# EAGLE design franzboard_V01_EAGLE61 (EAGLE 6.1)
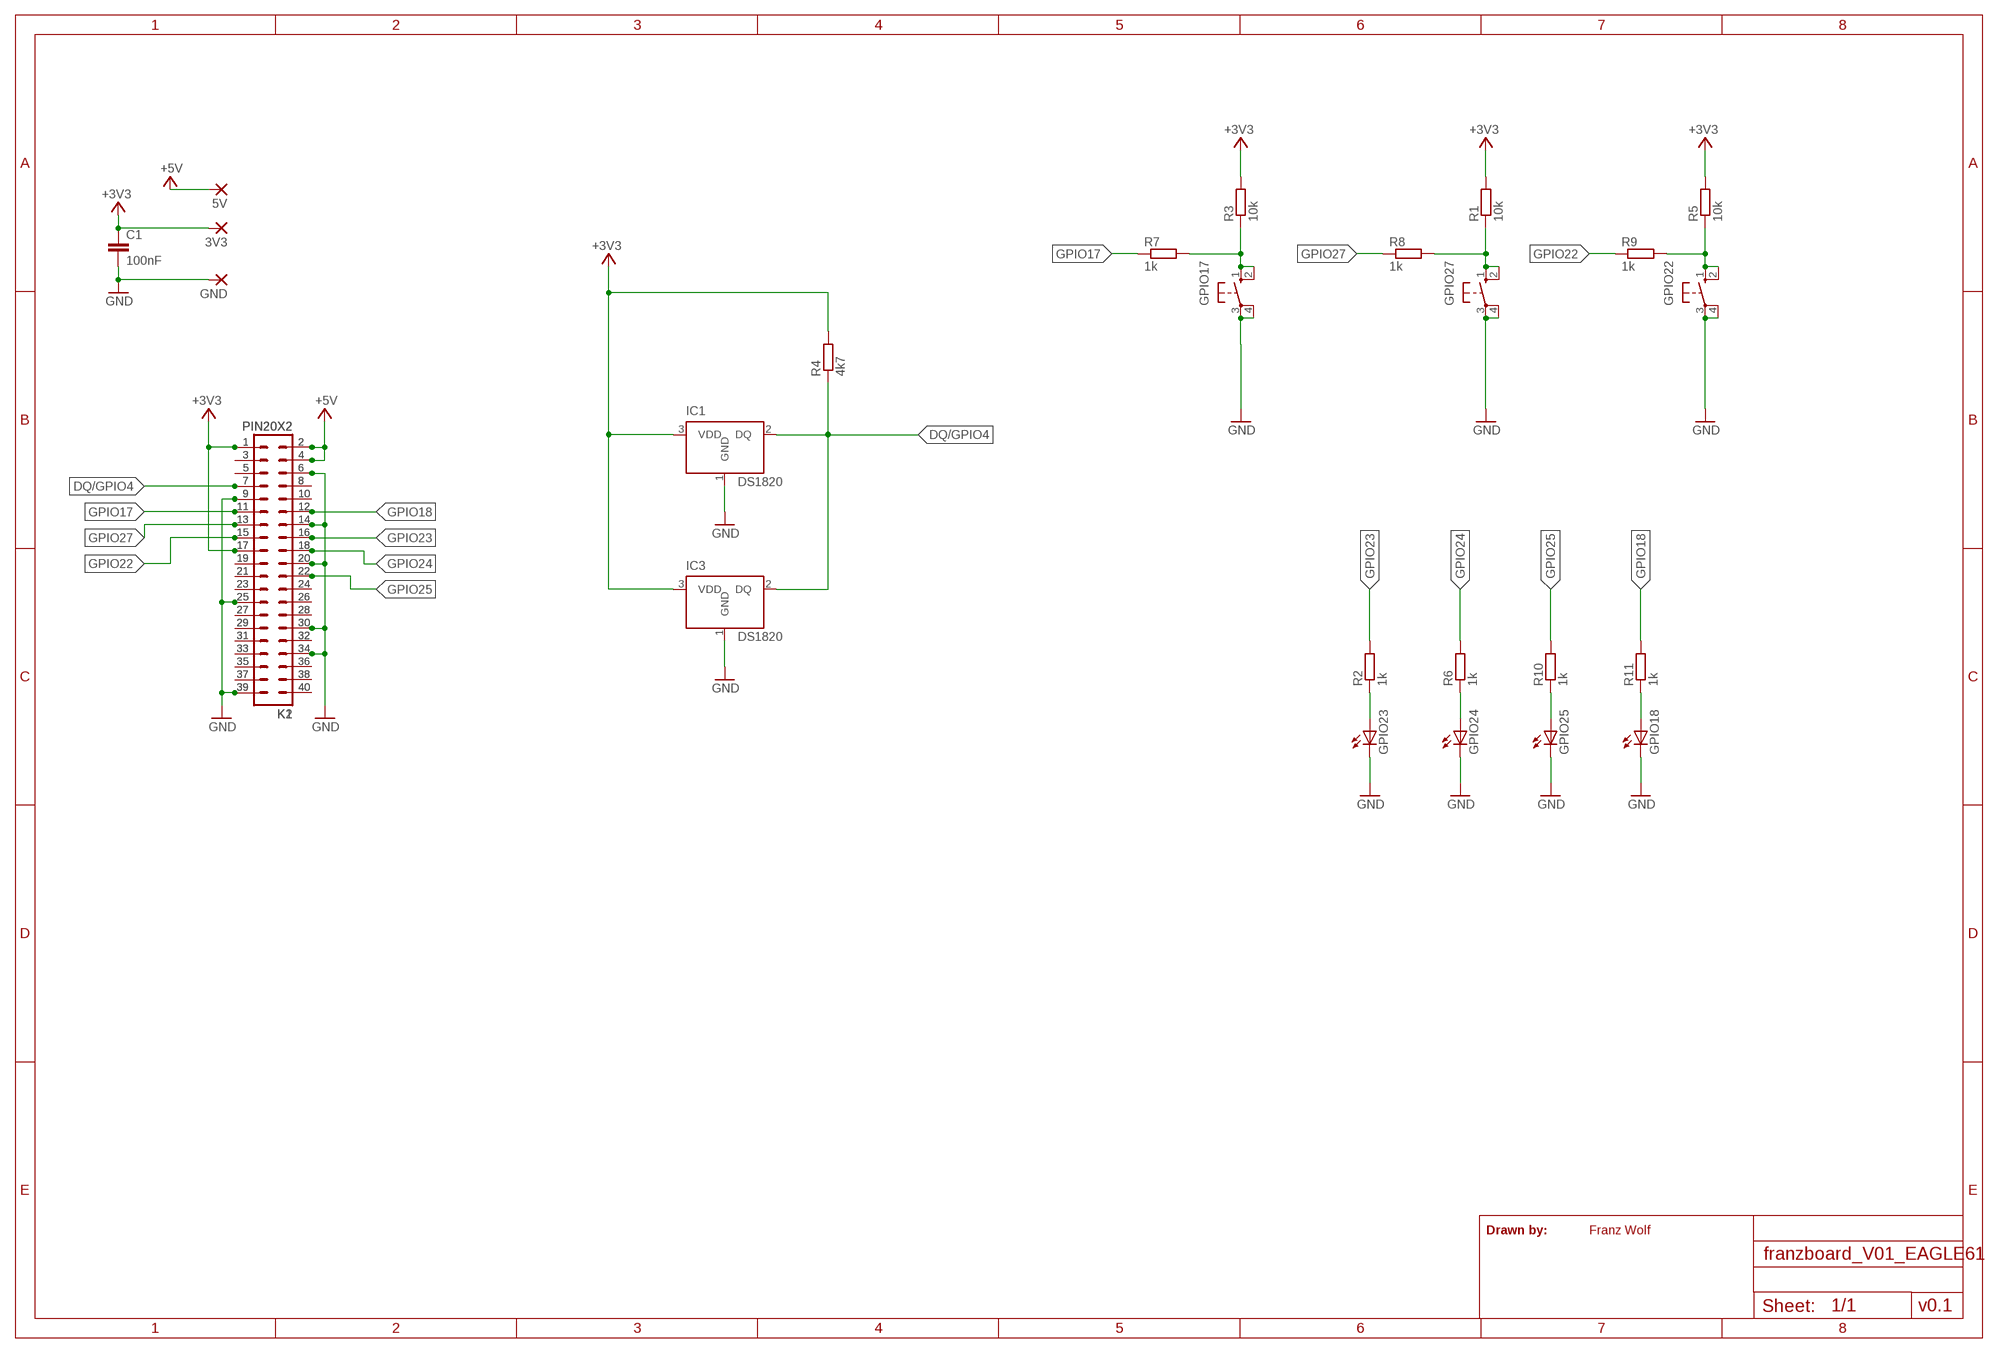
[diagram p0: schematic, sheet 1]

## Parts
3V3  1,6/0,8  [1,6/0,8]
5V  1,6/0,8  [1,6/0,8]
C1  100nF  C-EUC1206  [C1206]
GND  1,6/0,8  [1,6/0,8]
GPIO17  10-XX  [B3F-10XX]
GPIO18  LEDSMT1206  [1206]
GPIO22  10-XX  [B3F-10XX]
GPIO23  LEDSMT1206  [1206]
GPIO24  LEDSMT1206  [1206]
GPIO25  LEDSMT1206  [1206]
GPIO27  10-XX  [B3F-10XX]
IC1  DS1820  [TO-92]
IC3  DS1820  [TO-92]
K1  PIN20X2  [PIN_20X2]
K2  PIN20X2  [PIN_20X2]
R1  10k  R-EU_R1206  [R1206]
R2  1k  R-EU_R1206  [R1206]
R3  10k  R-EU_R1206  [R1206]
R4  4k7  R-EU_R1206  [R1206]
R5  10k  R-EU_R1206  [R1206]
R6  1k  R-EU_R1206  [R1206]
R7  1k  R-EU_R1206  [R1206]
R8  1k  R-EU_R1206  [R1206]
R9  1k  R-EU_R1206  [R1206]
R10  1k  R-EU_R1206  [R1206]
R11  1k  R-EU_R1206  [R1206]

## Nets
+3V3: 3V3.1(P) C1.1 IC1.3(VDD) IC3.3(VDD) K1.1 K1.17 K2.1 K2.17 R1.2 R3.2 R4.2 R5.2
+5V: 5V.1(P) K1.2 K1.4 K2.2 K2.4
DQ/GPIO4: IC1.2(DQ) IC3.2(DQ) K1.7 K2.7 R4.1
GND: C1.2 GND.1(P) GPIO17.3(P) GPIO17.4(P1) GPIO18.C GPIO22.3(P) GPIO22.4(P1) GPIO23.C GPIO24.C GPIO25.C GPIO27.3(P) GPIO27.4(P1) IC1.1(GND) IC3.1(GND) K1.6 K1.9 K1.14 K1.20 K1.25 K1.30 K1.34 K1.39 K2.6 K2.9 K2.14 K2.20 K2.25 K2.30 K2.34 K2.39
GPIO17: K1.11 K2.11 R7.1
GPIO18: K1.12 K2.12 R11.2
GPIO22: K1.15 K2.15 R9.1
GPIO23: K1.16 K2.16 R2.2
GPIO24: K1.18 K2.18 R6.2
GPIO25: K1.22 K2.22 R10.2
GPIO27: K1.13 K2.13 R8.1
N$1: K1.3 K2.3
N$2: K1.5 K2.5
N$3: GPIO23.A R2.1
N$4: GPIO17.1(S) GPIO17.2(S1) R3.1 R7.2
N$5: GPIO27.1(S) GPIO27.2(S1) R1.1 R8.2
N$6: GPIO22.1(S) GPIO22.2(S1) R5.1 R9.2
N$7: GPIO24.A R6.1
N$8: GPIO25.A R10.1
N$9: GPIO18.A R11.1
N$10: K1.19 K2.19
N$11: K1.21 K2.21
N$12: K1.23 K2.23
N$13: K1.24 K2.24
N$14: K1.26 K2.26
N$15: K1.27 K2.27
N$16: K1.29 K2.29
N$17: K1.28 K2.28
N$18: K1.31 K2.31
N$19: K1.33 K2.33
N$20: K1.32 K2.32
N$21: K1.36 K2.36
N$22: K1.38 K2.38
N$23: K1.40 K2.40
N$24: K1.35 K2.35
N$25: K1.37 K2.37
RXD: K1.10 K2.10
TXD: K1.8 K2.8

## Notes on the sheet
- Drawn by: | Franz Wolf
- v0.1

## Library data of the parts
3V3 5V GND = wirepad:1,6/0,8: THROUGH-HOLE PAD
C1 = resistor:C-EU: CAPACITOR, European symbol; DIELECTRIC: X7R
GPIO17 GPIO22 GPIO27 = switch-omron:10-XX: OMRON SWITCH; MPN: B3F-1000; OC_FARNELL: 176432; OC_NEWARK: 36M3542
GPIO18 GPIO23-GPIO25 = led:LED: LED OSRAM: - CHIPLED LG R971, LG N971, LY N971, LG Q971, LY Q971, LO R971, LY R971 LH N974, LH R974 LS Q976, LO Q976, LY Q976 LO Q996 - Hyper CHIPLED LW Q18S LB Q993, LB Q99A, LB R99A - SideLED LS A670, LO A670, LY A670, LG A670, LP A670 LB A673, LV A673, LT A673, LW A673 LH A674 LY A675 LS A676, LA A676, LO A676, LY A676, LW A676 LS A679, LY A679, LG A679 - Hyper Micro SIDELED® LS Y876, LA Y876, LO Y876, LY Y876 LT Y87S - SmartLED LW L88C, LW L88S LB L89C, LB L89S, LG L890 LS L89K, LO L89K, LY L89K LS L896, LA L896, LO L896, LY L896 - TOPLED LS T670, LO T670, LY T670, LG T670, LP T670 LSG T670, LSP T670, LSY T670, LOP T670, LYG T670 LG T671, LOG T671, LSG T671 LB T673, LV T673, LT T673, LW T673 LH T674 LS T676, LA T676, LO T676, LY T676, LB T676, LH T676, LSB T676, LW T676 LB T67C, LV T67C, LT T67C, LS T67K, LO T67K, LY T67K, LW E67C LS E67B, LA E67B, LO E67B, LY E67B, LB E67C, LV E67C, LT E67C LW T67C LS T679, LY T679, LG T679 LS T770, LO T770, LY T770, LG T770, LP T770 LB T773, LV T773, LT T773, LW T773 LH T774 LS E675, LA E675, LY E675, LS T675 LS T776, LA T776, LO T776, LY T776, LB T776 LHGB T686 LT T68C, LB T68C - Hyper Mini TOPLED® LB M676 - Mini TOPLED Santana® LG M470 LS M47K, LO M47K, LY M47K Source: http://www.osram.convergy.de LUXEON: - LUMILED® LXK2-PW12-R00, LXK2-PW12-S00, LXK2-PW14-U00, LXK2-PW14-V00 LXK2-PM12-R00, LXK2-PM12-S00, LXK2-PM14-U00 LXK2-PE12-Q00, LXK2-PE12-R00, LXK2-PE12-S00, LXK2-PE14-T00, LXK2-PE14-U00 LXK2-PB12-K00, LXK2-PB12-L00, LXK2-PB12-M00, LXK2-PB14-N00, LXK2-PB14-P00, LXK2-PB14-Q00 LXK2-PR12-L00, LXK2-PR12-M00, LXK2-PR14-Q00, LXK2-PR14-R00 LXK2-PD12-Q00, LXK2-PD12-R00, LXK2-PD12-S00 LXK2-PH12-R00, LXK2-PH12-S00 LXK2-PL12-P00, LXK2-PL12-Q00, LXK2-PL12-R00 Source: www.luxeon.com KINGBRIGHT: KA-3528ASYC Source: www.kingbright.com
IC1 IC3 = DS1820:DS1820: DS1820 - 1-Wire Digital Thermometer
K1 K2 = FLYFISH:PIN20X2
R1-R11 = rcl:R-EU_: RESISTOR, European symbol

## Board
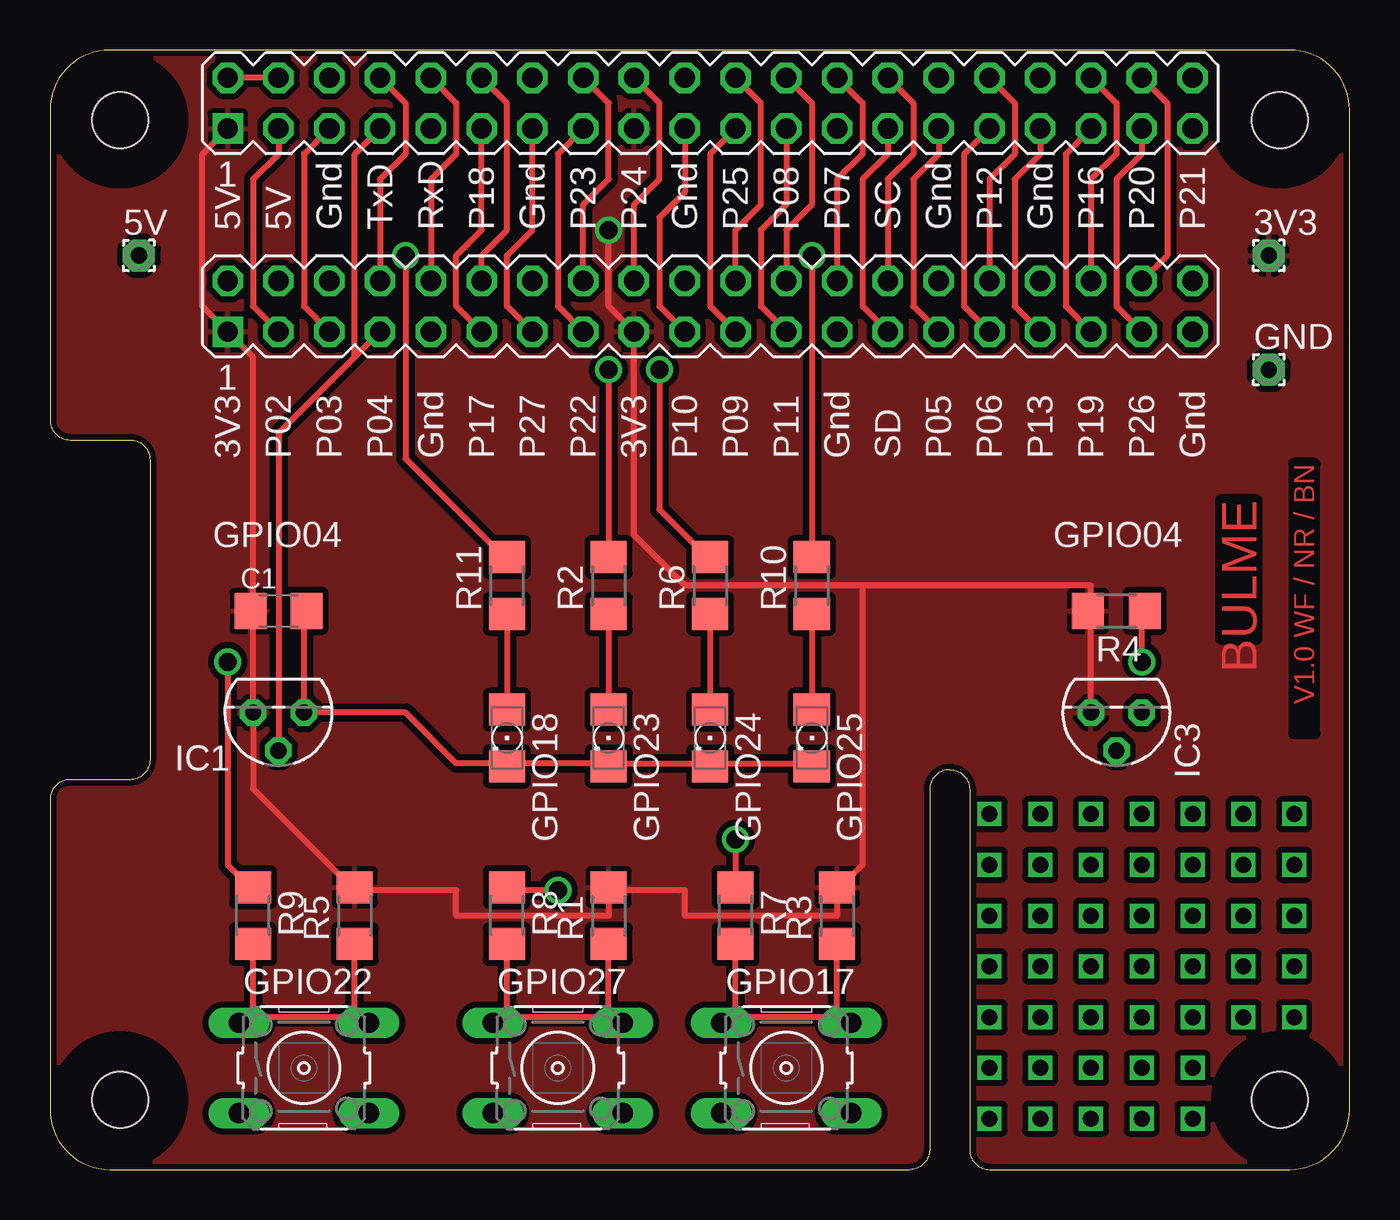
[diagram p1: board, top side]
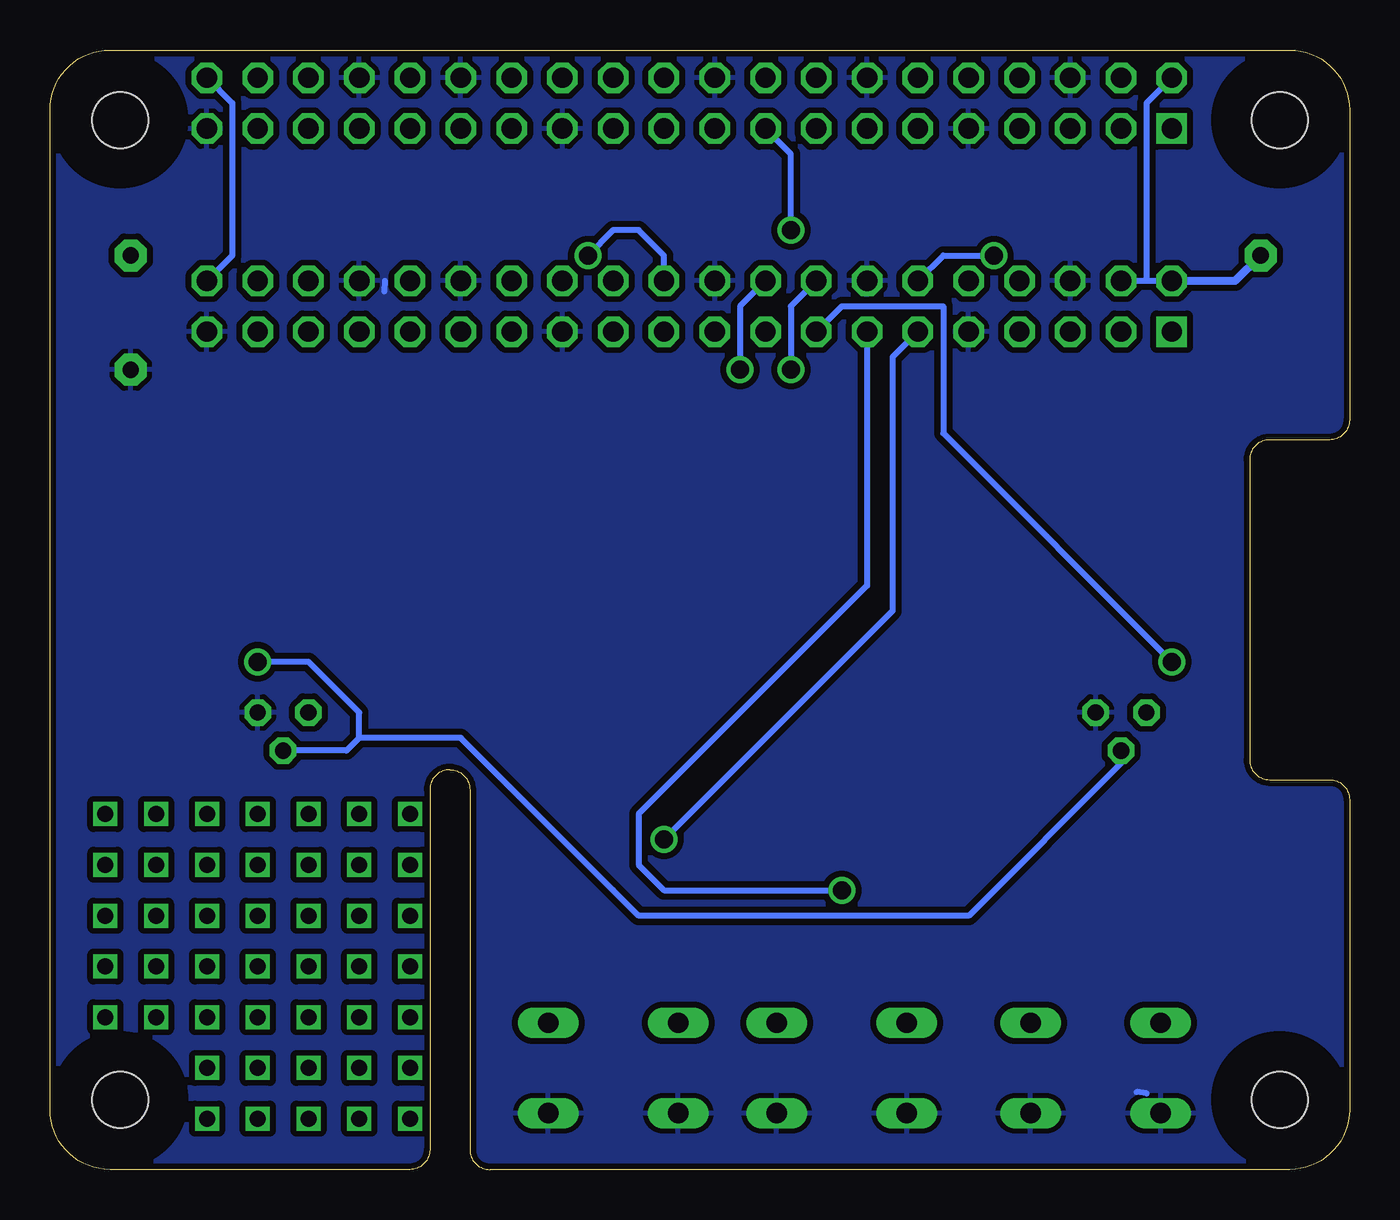
[diagram p2: board, bottom side, seen from below]

Size 65 x 56 mm. Coordinates in mm from the lower left corner, seen from the top.
Outline: 0,3 arc90 3,0 43,0 arc90 44,1 44,19 arc-90 45,20 arc-90 46,19 46,1 arc90 47,0 62,0 arc90 65,3 65,53 arc90 62,56 3,56 arc90 0,53 0,37.5 arc90 1,36.5 4,36.5 arc-90 5,35.5 5,20.5 arc-90 4,19.5 1,19.5 arc90 0,18.5 0,3
Copper layers (1*16): Top 0.035mm / dielectric 1.5mm / Bottom 0.035mm
Design rules: minimum track width 12mil, minimum drill 16mil, track to track 6mil, track to pad 8mil, pad to pad 8mil, via to via 8mil, smd to smd 0mil, copper to edge 10mil, drill to drill 12mil, minimum pad ring 10mil, minimum via ring 6mil, stop-mask expansion 2mil, vias tented up to drill 100mil, thermal gap 10mil
Holes 2.8 mm at 3.5,3.5 3.5,52.5 61.5,52.5 61.5,3.5
tRestrict: area 1.9,51 to 5,54; area 60,51 to 63,54; area 60,1.9 to 63,5; area 1.9,1.9 to 5,5
bRestrict: area 1.9,1.9 to 5,5; area 1.9,51 to 5,54; area 60,1.9 to 63,5; area 60,51 to 63,54

### Footprints (pad centres in the part's own frame; a part is rotated, then mirrored left to right if it is on the bottom)
1,6/0,8 = drill 0.813 pad 1.6 octagon: 1 0,0
C1206 = smd 1.6 x 1.8: 1 -1.4,0; 2 1.4,0
B3F-10XX = drill 1.016 long: 1 -3.251,2.261; 2 3.251,2.261; 3 -3.251,-2.261; 4 3.251,-2.261
1206 = smd 1.6 x 1.803: A -1.422,0; C 1.422,0
TO-92 = drill 0.813 pad 1.27 octagon: 1 -1.27,0; 2 0,1.905; 3 1.27,0
PIN_20X2 = drill 1.016 square: 1 -24.13,-1.27 | drill 1.016 octagon: 2 -24.13,1.27; 3 -21.59,-1.27; 4 -21.59,1.27; 5 -19.05,-1.27; 6 -19.05,1.27; 7 -16.51,-1.27; 8 -16.51,1.27; 9 -13.97,-1.27; 10 -13.97,1.27; 11 -11.43,-1.27; 12 -11.43,1.27; 13 -8.89,-1.27; 14 -8.89,1.27; 15 -6.35,-1.27; 16 -6.35,1.27; 17 -3.81,-1.27; 18 -3.81,1.27; 19 -1.27,-1.27; 20 -1.27,1.27; 21 1.27,-1.27; 22 1.27,1.27; 23 3.81,-1.27; 24 3.81,1.27; 25 6.35,-1.27; 26 6.35,1.27; 27 8.89,-1.27; 28 8.89,1.27; 29 11.43,-1.27; 30 11.43,1.27; 31 13.97,-1.27; 32 13.97,1.27; 33 16.51,-1.27; 34 16.51,1.27; 35 19.05,-1.27; 36 19.05,1.27; 37 21.59,-1.27; 38 21.59,1.27; 39 24.13,-1.27; 40 24.13,1.27
R1206 = smd 1.6 x 1.803: 1 -1.422,0; 2 1.422,0

### Placement (x,y rotation side)
3V3  60.96,45.72 0 top
5V  4.45,45.72 0 top
C1  11.43,27.94 0 top
GND  60.96,40.01 0 top
GPIO17  36.83,5.08 0 top
GPIO18  22.86,21.59 270 top
GPIO22  12.7,5.08 0 top
GPIO23  27.94,21.59 270 top
GPIO24  33.02,21.59 270 top
GPIO25  38.1,21.59 270 top
GPIO27  25.4,5.08 0 top
IC1  11.43,22.86 180 top
IC3  53.34,22.86 180 top
K1  33.02,53.34 0 top
K2  33.02,43.18 0 top
R1  27.94,12.7 90 top
R2  27.94,29.21 90 top
R3  39.37,12.7 90 top
R4  53.34,27.94 180 top
R5  15.24,12.7 90 top
R6  33.02,29.21 90 top
R7  34.29,12.7 270 top
R8  22.86,12.7 270 top
R9  10.16,12.7 270 top
R10  38.1,29.21 90 top
R11  22.86,29.21 90 top

### Tracks (layer width: path | path; a pad name or v marks a point on that pad's centre or on a via)
+3V3  (via drill 0.9)
  Top 0.305: 10.16,27.94 IC1.3 10.16,19.05 15.24,13.97 | 10.16,27.94 C1.1 10.16,27.94 | 15.24,13.97 R5.2 15.24,13.97 | 10.16,27.94 10.16,40.64 K2.1 7.62,43.18 7.62,50.8 K1.1 | 27.94,13.97 31.75,13.97 31.75,12.7 39.37,12.7 39.37,13.97 | 27.94,13.97 R1.2 27.94,13.97 | 39.37,13.97 R3.2 39.37,13.97 | IC3.3 52.07,27.94 | 52.07,27.94 R4.2 52.07,27.94 | 40.64,29.21 52.07,29.21 52.07,27.94 | 40.64,29.21 31.75,29.21 29.21,31.75 K2.17 27.94,43.18 v27.94,46.99 | 39.37,13.97 40.64,15.24 40.64,29.21 | 15.24,13.97 20.32,13.97 20.32,12.7 27.94,12.7 27.94,13.97
  Bottom 0.305: K1.17 27.94,50.8 v27.94,46.99
  pour Top (isolate 0.305): 0,3 arc90 3,0 43,0 arc90 44,1 44,19 arc-90 45,20 arc-90 46,19 46,1 arc90 47,0 62,0 arc90 65,3 65,53 arc90 62,56 3,56 arc90 0,53 0,37.5 arc90 1,36.5 4,36.5 arc-90 5,35.5 5,20.5 arc-90 4,19.5 1,19.5 arc90 0,18.5
+5V
  Top 0.305: K1.4 K1.2
  Bottom 0.305: K2.4 10.16,44.45 | 10.16,44.45 K2.2 | 10.16,44.45 10.16,53.34 K1.2
  Bottom 0.406: K2.2 5.71,44.45 5V.1
DQ/GPIO4  (via drill 0.9)
  Top 0.305: K2.7 15.24,40.64 | 15.24,40.64 11.43,36.83 11.43,21.59 IC1.2 | K1.7 15.24,50.8 15.24,40.64 | v54.61,25.4 54.61,27.94 R4.1
  Bottom 0.305: v54.61,25.4 52.07,25.4 49.53,22.86 49.53,21.59 | 49.53,21.59 44.45,21.59 36.83,13.97 35.56,12.7 19.05,12.7 11.43,20.32 IC1.2 | 49.53,21.59 50.16,20.95 IC3.2
GND
  Top 0.305: C1.2 12.7,27.94 IC1.1 17.78,22.86 20.32,20.32 22.86,20.32 | 27.94,20.32 22.86,20.32 | 22.86,20.32 GPIO18.C 22.86,20.32 | 27.94,20.32 GPIO23.C 27.94,20.32 | 27.94,20.32 33.02,20.32 | 33.02,20.32 GPIO24.C 33.02,20.32 | 33.02,20.32 38.1,20.32 GPIO25.C
  Bottom 0.305: K2.6 14.1,44.58 | K2.30 44.58,44.58 | 10.16,3.81 10.65,3.88 10.16,3.81 | 48.26,44.45 48.28,43.91 48.26,44.45
  pour Bottom (isolate 0.305): 0,3 arc90 3,0 43,0 arc90 44,1 44,19 arc-90 45,20 arc-90 46,19 46,1 arc90 47.63,0 62,0 arc90 65,3 65,53 arc90 62,56 3,56 arc90 0,53 0,37.5 arc90 1,36.5 4,36.5 arc-90 5,35.5 5,20.5 arc-90 4,19.5 1,19.5 arc90 0,18.5
GPIO17  (via drill 0.9)
  Top 0.305: v34.29,16.51 R7.1 | R7.1 34.29,13.97 R7.1 | K1.11 21.59,46.99 20.32,45.72 20.32,43.18 K2.11
  Bottom 0.305: v34.29,16.51 22.86,27.94 22.86,40.64 K2.11
GPIO18  (via drill 0.9)
  Top 0.305: v17.78,45.72 17.78,35.56 22.86,30.48 R11.2 | K1.12 22.86,53.34 22.86,46.99 21.59,45.72 K2.12
  Bottom 0.305: v17.78,45.72 20.32,45.72 K2.12
GPIO22  (via drill 0.9)
  Top 0.305: K2.15 25.4,43.18 25.4,50.8 K1.15 | v8.89,25.4 8.89,15.24 10.16,13.97 R9.1
  Bottom 0.305: v8.89,25.4 20.32,36.83 20.32,43.18 25.4,43.18 K2.15
GPIO23  (via drill 0.9)
  Top 0.305: v27.94,40.01 R2.2 | R2.2 27.94,30.48 R2.2 | K1.16 27.94,53.34 27.94,49.53 26.67,48.26 K2.16
  Bottom 0.305: v27.94,40.01 27.94,43.18 K2.16
GPIO24  (via drill 0.9)
  Top 0.305: v30.48,40.01 30.48,33.02 33.02,30.48 R6.2 | K1.18 30.48,53.34 30.48,49.53 29.21,48.26 K2.18
  Bottom 0.305: v30.48,40.01 30.48,43.18 K2.18
GPIO25  (via drill 0.9)
  Top 0.305: v38.1,45.72 R10.2 | R10.2 38.1,30.48 R10.2 | K1.22 35.56,53.34 35.56,48.26 34.29,46.99 K2.22
  Bottom 0.305: v38.1,45.72 36.83,46.99 35.56,46.99 34.29,45.72 K2.22
GPIO27  (via drill 0.9)
  Top 0.305: K1.13 24.13,46.99 22.86,45.72 22.86,43.18 K2.13 | v25.4,13.97 22.86,13.97 R8.1
  Bottom 0.305: v25.4,13.97 34.29,13.97 35.56,15.24 35.56,17.78 24.13,29.21 K2.13
N$1
  Top 0.305: K2.3 10.16,43.18 10.16,49.53 11.43,50.8 K1.3
N$2
  Top 0.305: K2.5 12.7,43.18 12.7,50.8 K1.5
N$3
  Top 0.305: R2.1 27.94,27.94 R2.1 | R2.1 GPIO23.A | GPIO23.A 27.94,22.86 GPIO23.A
N$4
  Top 0.305: 34.29,7.62 R7.2 | R7.2 34.29,11.43 R7.2 | 34.29,7.62 GPIO17.1 34.29,7.62 | 39.37,7.62 R3.1 | R3.1 39.37,11.43 R3.1 | 39.37,7.62 GPIO17.2 39.37,7.62 | 39.37,7.62 34.29,7.62
N$5
  Top 0.305: 22.86,7.62 R8.2 | R8.2 22.86,11.43 R8.2 | 22.86,7.62 GPIO27.1 22.86,7.62 | 27.94,7.62 R1.1 | R1.1 27.94,11.43 R1.1 | 27.94,7.62 GPIO27.2 27.94,7.62 | 27.94,7.62 22.86,7.62
N$6
  Top 0.305: 10.16,7.62 R9.2 | R9.2 10.16,11.43 R9.2 | 10.16,7.62 GPIO22.1 10.16,7.62 | 15.24,7.62 R5.1 | R5.1 15.24,11.43 R5.1 | 15.24,7.62 GPIO22.2 15.24,7.62 | 15.24,7.62 10.16,7.62
N$7
  Top 0.305: R6.1 33.02,27.94 R6.1 | R6.1 GPIO24.A | GPIO24.A 33.02,22.86 GPIO24.A
N$8
  Top 0.305: R10.1 38.1,27.94 R10.1 | R10.1 GPIO25.A | GPIO25.A 38.1,22.86 GPIO25.A
N$9
  Top 0.305: R11.1 22.86,27.94 R11.1 | R11.1 GPIO18.A | GPIO18.A 22.86,22.86 GPIO18.A
N$10
  Top 0.305: K2.19 30.48,43.18 30.48,47.62 31.75,48.9 K1.19
N$11
  Top 0.305: K2.21 33.02,43.18 33.02,50.8 K1.21
N$12
  Top 0.305: K2.23 35.56,43.18 35.56,46.99 36.83,48.26 K1.23
N$13
  Top 0.305: K2.24 36.83,46.99 38.1,48.26 38.1,53.34 K1.24
N$14
  Top 0.305: K2.26 39.37,49.53 40.64,50.8 40.64,53.34 K1.26
N$15
  Top 0.305: K2.27 40.64,43.18 40.64,49.53 41.91,50.8 K1.27
N$16
  Top 0.305: K2.29 43.18,43.18 43.18,49.53 44.45,50.8 K1.29
N$17
  Top 0.305: K2.28 41.91,49.53 43.18,50.8 43.18,53.34 K1.28
N$18
  Top 0.305: K2.31 45.72,43.18 45.72,50.8 K1.31
N$19
  Top 0.305: K2.33 48.26,43.18 48.26,49.53 49.53,50.8 K1.33
N$20
  Top 0.305: K2.32 46.99,49.53 48.26,50.8 48.26,53.34 K1.32
N$21
  Top 0.305: K2.36 52.07,49.53 53.34,50.8 53.34,53.34 K1.36
N$22
  Top 0.305: K2.38 55.88,45.72 55.88,53.34 K1.38
N$23
  Bottom 0.305: K2.40 55.88,45.72 55.88,53.34 K1.40
N$24
  Top 0.305: K2.35 50.8,43.18 50.8,50.8 K1.35
N$25
  Top 0.305: K2.37 53.34,43.18 53.34,49.53 54.61,50.8 K1.37
N$26  (via drill 0.8)
  other vias: 46.99,2.54
N$27  (via drill 0.8)
  other vias: 49.53,2.54
N$28  (via drill 0.8)
  other vias: 52.07,2.54
N$29  (via drill 0.8)
  other vias: 54.61,2.54
N$30  (via drill 0.8)
  other vias: 54.61,5.08
N$31  (via drill 0.8)
  other vias: 52.07,5.08
N$32  (via drill 0.8)
  other vias: 49.53,5.08
N$33  (via drill 0.8)
  other vias: 46.99,5.08
N$34  (via drill 0.8)
  other vias: 46.99,7.62
N$35  (via drill 0.8)
  other vias: 49.53,7.62
N$36  (via drill 0.8)
  other vias: 52.07,7.62
N$37  (via drill 0.8)
  other vias: 54.61,7.62
N$38  (via drill 0.8)
  other vias: 54.61,10.16
N$39  (via drill 0.8)
  other vias: 52.07,10.16
N$40  (via drill 0.8)
  other vias: 49.53,10.16
N$41  (via drill 0.8)
  other vias: 46.99,10.16
N$42  (via drill 0.8)
  other vias: 46.99,12.7
N$43  (via drill 0.8)
  other vias: 49.53,12.7
N$44  (via drill 0.8)
  other vias: 52.07,12.7
N$45  (via drill 0.8)
  other vias: 54.61,12.7
N$46  (via drill 0.8)
  other vias: 54.61,15.24
N$47  (via drill 0.8)
  other vias: 52.07,15.24
N$48  (via drill 0.8)
  other vias: 49.53,15.24
N$49  (via drill 0.8)
  other vias: 46.99,15.24
N$50  (via drill 0.8)
  other vias: 46.99,17.78
N$51  (via drill 0.8)
  other vias: 49.53,17.78
N$52  (via drill 0.8)
  other vias: 52.07,17.78
N$53  (via drill 0.8)
  other vias: 54.61,17.78
N$54  (via drill 0.8)
  other vias: 57.15,17.78
N$55  (via drill 0.8)
  other vias: 57.15,15.24
N$56  (via drill 0.8)
  other vias: 57.15,12.7
N$57  (via drill 0.8)
  other vias: 57.15,10.16
N$58  (via drill 0.8)
  other vias: 57.15,7.62
N$59  (via drill 0.8)
  other vias: 57.15,5.08
N$60  (via drill 0.8)
  other vias: 57.15,2.54
N$61  (via drill 0.8)
  other vias: 59.69,17.78
N$62  (via drill 0.8)
  other vias: 59.69,15.24
N$63  (via drill 0.8)
  other vias: 59.69,12.7
N$64  (via drill 0.8)
  other vias: 59.69,10.16
N$65  (via drill 0.8)
  other vias: 59.69,7.62
N$66  (via drill 0.8)
  other vias: 62.23,7.62
N$67  (via drill 0.8)
  other vias: 62.23,10.16
N$68  (via drill 0.8)
  other vias: 62.23,12.7
N$69  (via drill 0.8)
  other vias: 62.23,15.24
N$70  (via drill 0.8)
  other vias: 62.23,17.78
RXD
  Top 0.305: K2.10 19.05,49.53 20.32,50.8 20.32,53.34 K1.10
TXD
  Top 0.305: K2.8 16.51,49.53 17.78,50.8 17.78,53.34 K1.8

### Text on the board
Top: V1.0 WF / NR / BN | BULME
tPlace: 5V | 5V | Gnd | TxD | RxD | P18 | Gnd | P23 | P24 | Gnd | P25 | P08 | P07 | SC | Gnd | P12 | Gnd | P16 | P20 | P21 | 3V3 | P02 | P03 | P04 | Gnd | P17 | P27 | P22 | 3V3 | P10 | P09 | P11 | Gnd | SD | P05 | P06 | P13 | P19 | P26 | Gnd | GPIO04 | GPIO04